# Altium project Urukul.PrjPCB
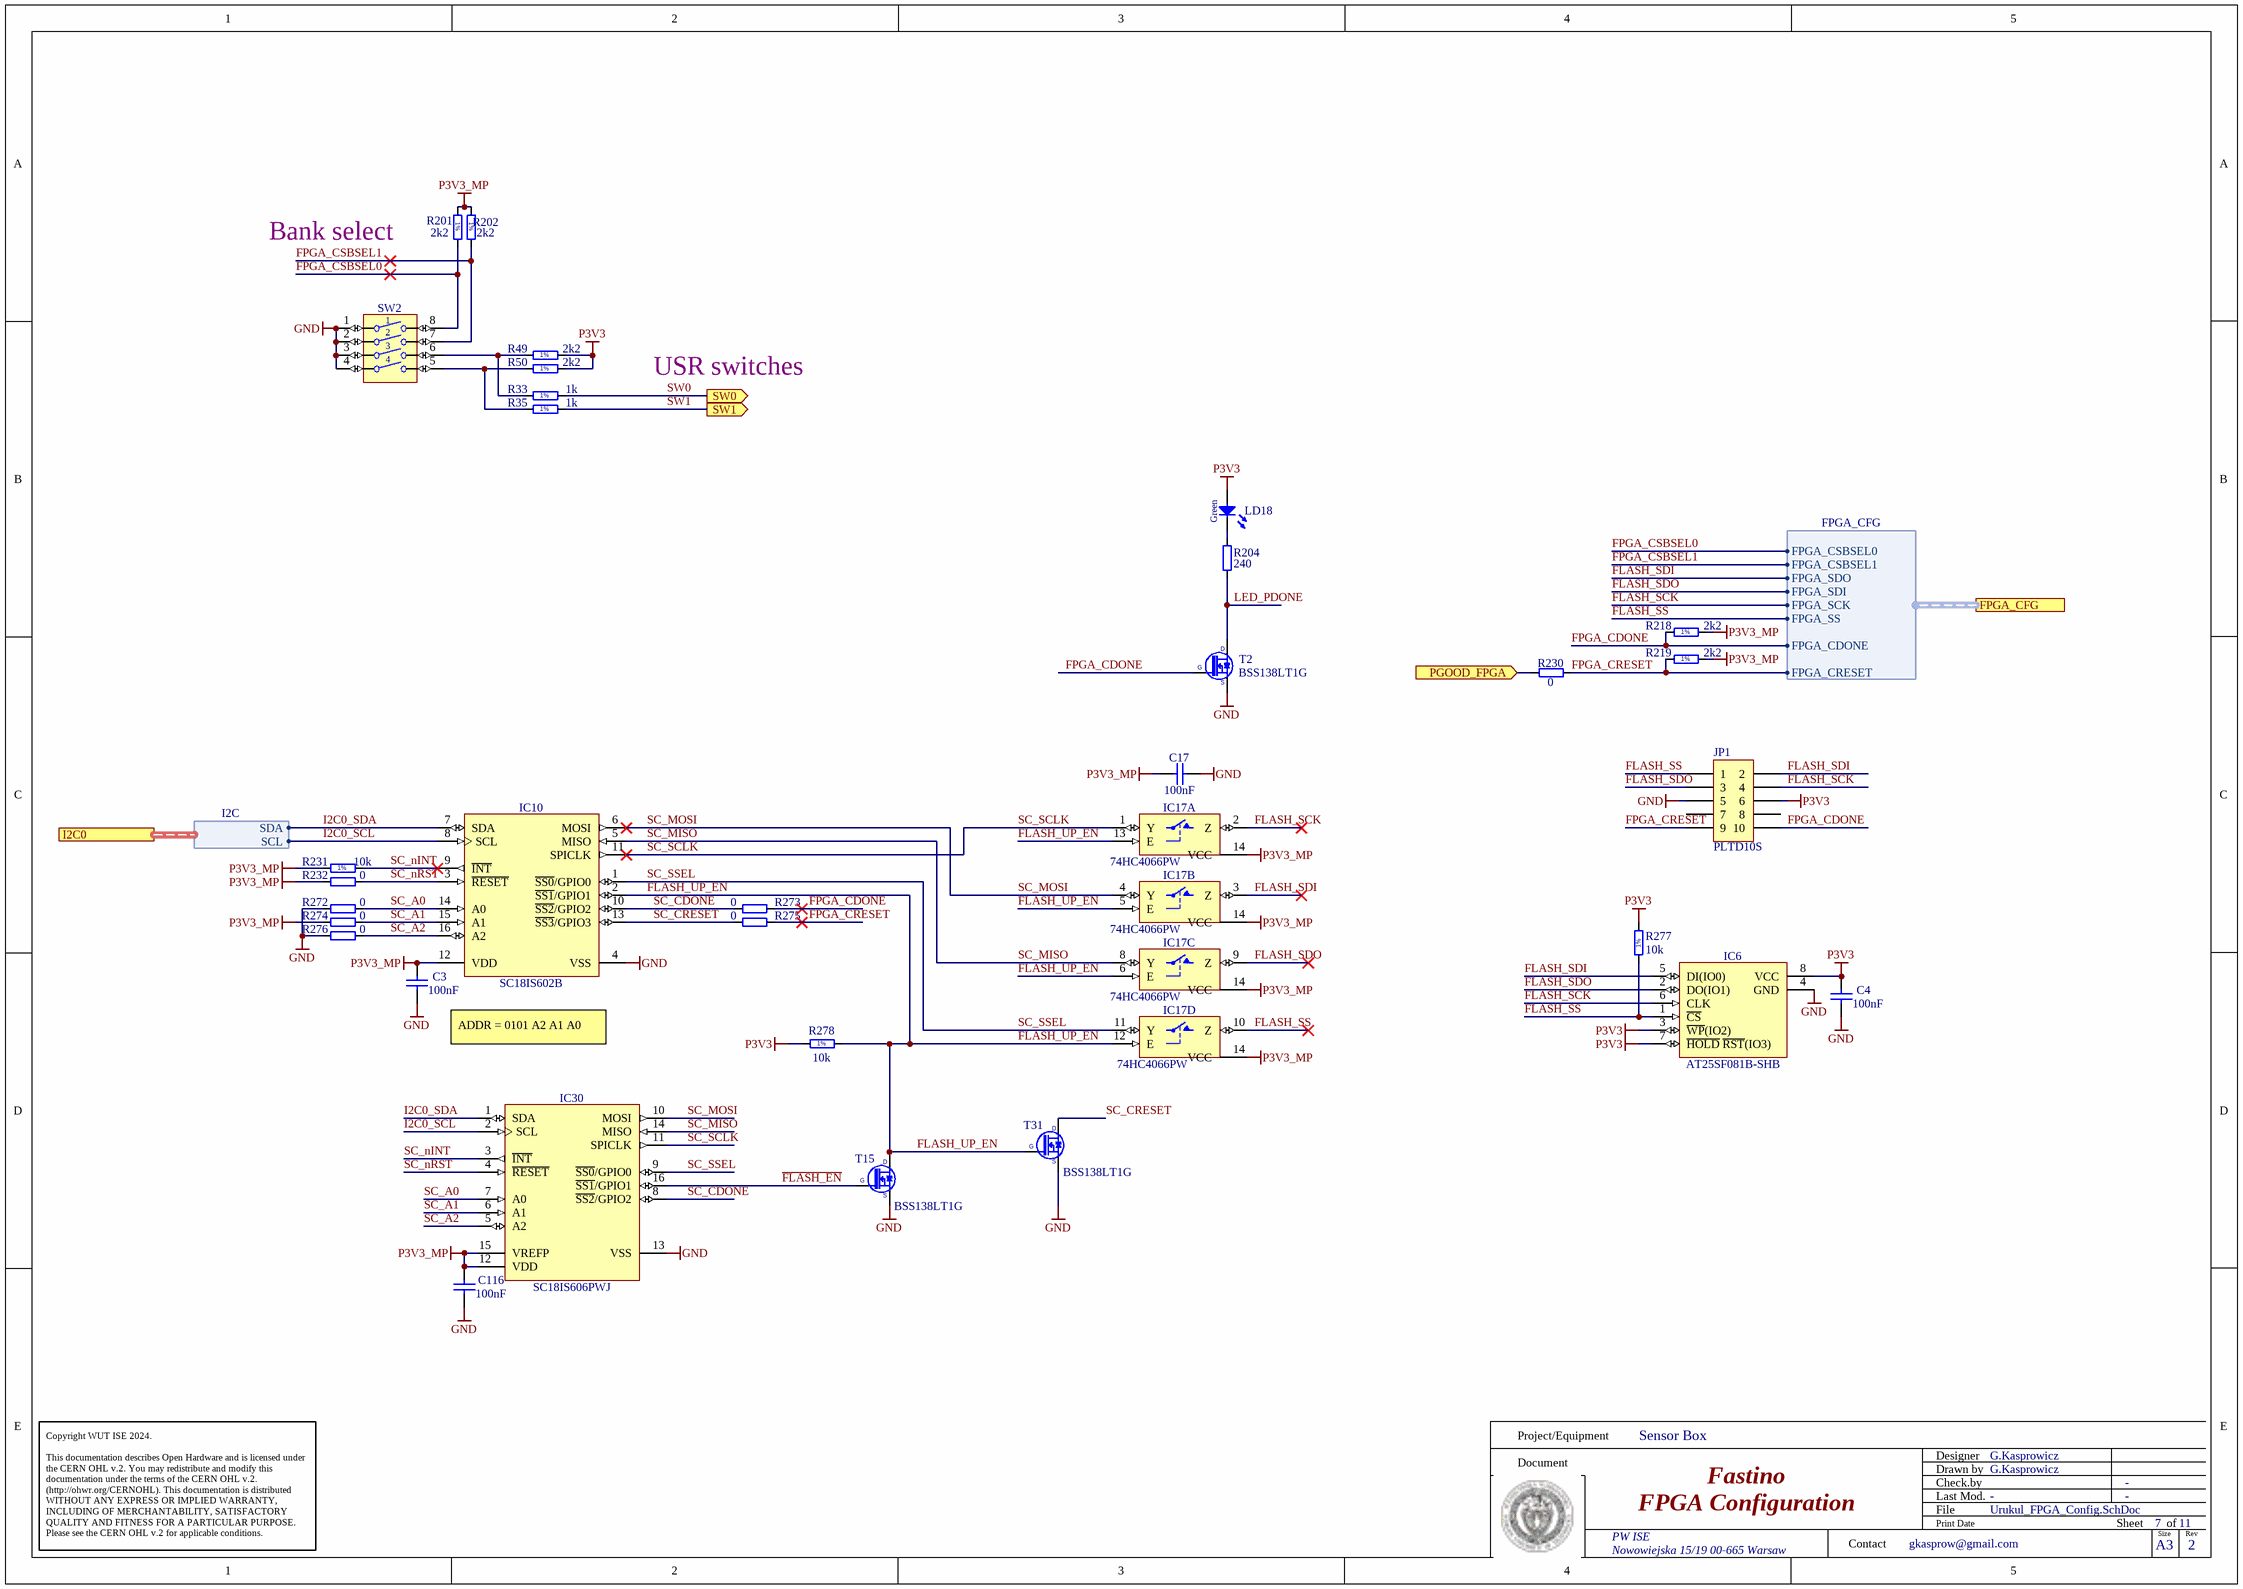
[diagram p0: Urukul_FPGA_Config.SchDoc]
P_version: 1.6.0
1 sheet, 33 parts. Net scope: hierarchical (ports join the sheet entries above them; power ports are global).
Board files: Urukul.PcbDoc, Panel_Urukul_9910.PcbDoc, Panel_Urukul_9912.PcbDoc

## Sheet Urukul_FPGA_Config.SchDoc: Fastino
size 420 x 297 mm; EDA_Number: ARTIQ; Projet: Fastino; Author: G.Kasprowicz; CompanyName: WUT ISE; DrawnBy: G.Kasprowicz; Organization: WUT ISE; Address1: PW ISE; Address2: Nowowiejska 15/19 00-665 Warsaw; Address3: gkasprow@gmail.com; DocumentNumber: 5; Revision: 2; SheetNumber: 7; SheetTotal: 11; ModifiedBy: -; CheckedDate: -; Title2: FPGA Configuration; DivGrp: WUT ISE; Designer: G.Kasprowicz; ModifiedDate: -; ProjectName: Sensor Box

### Parts
C3  100nF  [CAPC1005X55N]
C4  100nF  [CAPC1005X55N]
C17  100nF  [CAPC1005X55N]
C116  100nF  [CAPC1005X55N]
IC6  AT25SF081B-SHB  [SOIC127P790X216-8N]
IC10  SC18IS602B  [SOP65P640X110-16N]
IC17  74HC4066PW  [SOP65P640X110-14N]  (parts A,B,C,D of 4)
IC30  SC18IS606PWJ  [SOP65P640X110-16N]
JP1  PLTD10S  [PLTD10S]
LD18  Green  [LED_AVAGO_HSME-C120]
R33  1k  [RESC1005X40N]
R35  1k  [RESC1005X40N]
R49  2k2  [RESC1005X40N]
R50  2k2  [RESC1005X40N]
R201  2k2  [RESC1005X40N]
R202  2k2  [RESC1005X40N]
R204  240  [RESC1005X40N]
R218  2k2  [RESC1005X40N]
R219  2k2  [RESC1005X40N]
R230  0  [RESC1005X40N]
R231  10k  [RESC1005X40N]
R232  0  [RESC1005X40N]
R272  0  [RESC1005X40N]
R273  0  [RESC1005X40N]
R274  0  [RESC1005X40N]
R275  0  [RESC1005X40N]
R276  0  [RESC1005X40N]
R277  10k  [RESC1005X40N]
R278  10k  [RESC1005X40N]
SW2  Switch  [SW_TYCO_1571983-4]  (value not drawn)
T2  BSS138LT1G  [SOT95P240X110-3N]
T15  BSS138LT1G  [SOT95P240X110-3N]
T31  BSS138LT1G  [SOT95P240X110-3N]

### Ports
FPGA_CFG (harness FPGA_CFG), I2C0 (harness I2C), PGOOD_FPGA (in), SW0 (out), SW1 (out)

### Harnesses
FPGA_CFG: FPGA_CSBSEL0, FPGA_CSBSEL1, FPGA_SDO, FPGA_SDI, FPGA_SCK, FPGA_SS, FPGA_CDONE, FPGA_CRESET
I2C: SDA, SCL

### Nets
GND: C3.1 C4.1 C17.2 C116.1 IC6.4(GND) IC10.4(VSS) IC17.7(GND) IC30.13(VSS) JP1.5 R272.2 R276.2 SW2.1 SW2.2 SW2.3 SW2.4 T2.2(S) T15.2(S) T31.2(S)
P3V3: C4.2 IC6.3(~{WP}(IO2)) IC6.7(~{HOLD}_~{RST}(IO3)) IC6.8(VCC) JP1.6 LD18.2(A) R49.2 R50.2 R277.2 R278.1
P3V3_MP: C3.2 C17.1 C116.2 IC10.12(VDD) IC17.14(VCC) IC30.12(VDD) IC30.15(VREFP) R201.1 R202.1 R218.2 R219.2 R231.1 R232.2 R274.2
~{FLASH}~{_EN}: IC30.16(~{SS1}/GPIO1) T15.1(G)
FLASH_SCK: IC6.6(CLK) IC17.2(Z) JP1.4 ; port FPGA_CFG.FPGA_SCK
FLASH_SDI: IC6.5(DI(IO0)) IC17.3(Z) JP1.2 ; port FPGA_CFG.FPGA_SDO
FLASH_SDO: IC6.2(DO(IO1)) IC17.9(Z) JP1.3 ; port FPGA_CFG.FPGA_SDI
FLASH_SS: IC6.1(~{CS}) IC17.10(Z) JP1.1 R277.1 ; port FPGA_CFG.FPGA_SS
FLASH_UP_EN: IC10.2(~{SS1}/GPIO1) IC17.5(E) IC17.6(E) IC17.12(E) IC17.13(E) R278.2 T15.3(D) T31.1(G)
FPGA_CDONE: JP1.10 R218.1 R273.1 T2.1(G) ; port FPGA_CFG.FPGA_CDONE
FPGA_CRESET: JP1.9 R219.1 R230.2 R275.1 ; port FPGA_CFG.FPGA_CRESET
FPGA_CSBSEL0: R201.2 SW2.8 ; port FPGA_CFG.FPGA_CSBSEL0
FPGA_CSBSEL1: R202.2 SW2.7 ; port FPGA_CFG.FPGA_CSBSEL1
I2C0_SCL: IC10.8(SCL) IC30.2(SCL) ; port I2C0.SCL
I2C0_SDA: IC10.7(SDA) IC30.1(SDA) ; port I2C0.SDA
LED_PDONE: R204.1 T2.3(D)
PGOOD_FPGA: R230.1 ; port PGOOD_FPGA
SC_A0: IC10.14(A0) IC30.7(A0) R272.1
SC_A1: IC10.15(A1) IC30.6(A1) R274.1
SC_A2: IC10.16(A2) IC30.5(A2) R276.1
SC_CDONE: IC10.10(~{SS2}/GPIO2) IC30.8(~{SS2}/GPIO2) R273.2
SC_CRESET: IC10.13(~{SS3}/GPIO3) R275.2 T31.3(D)
SC_MISO: IC10.5(MISO) IC17.8(Y) IC30.14(MISO)
SC_MOSI: IC10.6(MOSI) IC17.4(Y) IC30.10(MOSI)
SC_nINT: IC10.9(~{INT}) IC30.3(~{INT}) R231.2
SC_nRST: IC10.3(~{RESET}) IC30.4(~{RESET}) R232.1
SC_SCLK: IC10.11(SPICLK) IC17.1(Y) IC30.11(SPICLK)
SC_SSEL: IC10.1(~{SS0}/GPIO0) IC17.11(Y) IC30.9(~{SS0}/GPIO0)
SW0: R33.2 ; port SW0
SW1: R35.2 ; port SW1
NetLD18_1: LD18.1(C) R204.2
NetR33_1: R33.1 R49.1 SW2.6
NetR35_1: R35.1 R50.1 SW2.5

Not connected (* = marked no-connect by the designer): JP1 7 8

### Notes on the sheet
- Bank select
- USR switches
- ADDR = 0101 A2 A1 A0
- Project/Equipment
- Document
- Designer
- Drawn by
- Check.by
- Copyright WUT ISE 2024.
  This documentation describes Open Hardware and is licensed under the CERN OHL v.2. You may redistribute and modify this documentation under the terms of the CERN OHL v.2. (http://ohwr.org/CERNOHL). This documentation is distributed WITHOUT ANY EXPRESS OR IMPLIED WARRANTY, INCLUDING OF MERCHANTABILITY, SATISFACTORY QUALITY AND FITNESS FOR A PARTICULAR PURPOSE. Please see the CERN OHL v.2 for applicable conditions.
- Contact
- File
- Last Mod.
- Print Date
- Sheet
- Size
- A3
- of
- Rev
- (in symbol R0402_1K_1%_0.0625W_100PPM) 1%
- (in symbol R0402_2K2_1%_0.0625W_100PPM) 1%
- (in symbol R0402_10K_1%_0.0625W_100PPM) 1%

### Library data of the parts
C3 C4 C17 C116 = CC0402_100NF_16V_10%_X5R: Non-polarised capacitor; Part Description: SMD Multilayer Chip Ceramic Capacitor; Manufacturer: GENERIC; Manufacturer1 Part Number: GRM155R61C104KA88D; Voltage: 16V; TC: X5R; Tolerance: ±10%; Part Number: CC0402_100NF_16V_10%_X5R; Component Kind: Standard; Component Type: Standard; Pin Count: 2; Value: 100nF; Status: None; Manufacturer Part Number: CC0402_100NF_16V_10%_X5R; Case: 0402; Mounted: Yes; Socket: No; SMD: Yes; Sense: No; Manufacturer1 Example: MURATA; Manufacturer1 ComponentHeight: 0.55mm; HelpURL: \\cern.ch\dfs\Applications\Altium\Datasheets\CC0402_X5R_MURATA_GRM.pdf; Author: CERN DEM JLC; CreateDate: 10.12.2013; LatestRevisionDate: 10.12.2013
IC6 = MEM_AT25SF081B-SHB: 8M-bit Serial Flash Memory with uniform 4KB sectors and Dual/Quad SPI and QPI; Manufacturer: Renesas; PressFit: No; Bonding: No; Part Number: AT25SF081B-SHB; Component Kind: Standard; Component Type: Standard; Device: AT25SF081B-SHB; PackageDescription: SOIC, 1.27mm Pitch; 8 Pin, 5.285mm W X 5.335mm L X 2.16mm H body, IPC Medium Density; Part Description: 8M-bit Serial Flash Memory with uniform 4KB sectors and Dual/Quad SPI and QPI; Manufacturer Part Number: AT25SF081B-SHB; Pin Count: 8; Case: SOIC8; Mounted: Yes; Socket: No; SMD: Yes; Sense: No; ComponentHeight: 2.16mm; HelpURL: \\cern.ch\dfs\Applications\Altium\Datasheets\W25Q128FVSIG.pdf; Author: GK; CreateDate: 26/01/2018; LatestRevisionDate: 26/01/2018
IC10 = SC18IS602B: I2C-bus to SPI bridge; Manufacturer: NXP SEMICONDUCTORS; PressFit: No; Bonding: No; Part Number: SC18IS602B; Component Kind: Standard; Component Type: Standard; Device: SC18IS602B; PackageDescription: SOP, 0.65mm pitch; 16 pin, 4.40mm W X 5.00mm L X 1.10mm H body IPC Medium Density; Part Description: I2C-Bus to SPI Bridge; Manufacturer Part Number: SC18IS602B; Pin Count: 16; Case: TSSOP16; Mounted: Yes; Socket: No; SMD: Yes; Sense: No; ComponentHeight: 1.1mm; HelpURL: \\cern.ch\dfs\Applications\Altium\Datasheets\SC18IS602B.pdf; Author: CERN DEM MR; CreateDate: 14/12/2015; LatestRevisionDate: 14/12/2015
IC17 = 74HC4066PW: Part Description: Quad Single-Pole Single-Throw Analog Switch; Manufacturer: NXP SEMICONDUCTORS; PressFit: No; Bonding: No; Table: Standard Logic; Part Number: 74HC4066PW; Component Kind: Standard; Component Type: Standard; Device: 74HC4066PW; PackageDescription: SOP, 14-Leads, Body 4.4x5mm (max), Pitch 0.65mm, IPC Medium Density; Manufacturer Part Number: 74HC4066PW; Pin Count: 14; Case: TSSOP14; Mounted: Yes; Socket: No; SMD: Yes; ComponentHeight: 1.1mm; Author: CERN DEM JLC; HelpURL: \\cern.ch\dfs\Applications\Altium\Datasheets\74HC4066PW.pdf; CreateDate: 2014-11-19; LatestRevisionDate: 2014-11-19
IC30 = SC18IS606PWJ: I2C-bus to SPI bridge; Manufacturer: NXP SEMICONDUCTORS; PressFit: No; Bonding: No; Part Number: SC18IS606PWJ; Component Kind: Standard; Component Type: Standard; Device: SC18IS606PWJ; PackageDescription: SOP, 0.65mm pitch; 16 pin, 4.40mm W X 5.00mm L X 1.10mm H body IPC Medium Density; Part Description: I2C-Bus to SPI Bridge; Manufacturer Part Number: SC18IS606PWJ; Pin Count: 16; Case: TSSOP16; Mounted: Yes; Socket: No; SMD: Yes; Sense: No; ComponentHeight: 1.1mm; HelpURL: \\cern.ch\dfs\Applications\Altium\Datasheets\SC18IS602B.pdf; Author: GK; CreateDate: 14/12/2015; LatestRevisionDate: 14/12/2015
JP1 = CON_2x5 2.54 male SMT: Goldpin 2.54mm, male header; Manufacturer: Maritex; Manufacturer Part Number: PLTD10S; Part Number: PLTD10S
LD18 = LED_AVAGO_HSME-C120: LED Green 1C 2A; Part Description: High Performance Right Angle Chip Green LED; Manufacturer: AVAGO TECHNOLOGIES; PressFit: No; Bonding: No; Part Number: LED_AVAGO_HSME-C120; Component Kind: Standard; Component Type: Standard; Color: Green; PackageDescription: Green Chip LED, 2-Leads, Body 1.7x1.1mm, Side Emitting Package; Manufacturer Part Number: HSME-C120; Pin Count: 2; Mounted: Yes; Socket: No; SMD: Yes; Sense: No; ComponentHeight: 0.7mm; HelpURL: \\cern.ch\dfs\Applications\Altium\Datasheets\LED_AVAGO_HSME-C120.pdf; ComponentLink1URL: \\cern.ch\dfs\Applications\Altium\Datasheets\LED_AVAGO_HSME-C110_DESIGN-GUIDE.pdf; ComponentLink1Description: Design Guide; Author: CERN DEM JMW; CreateDate: 22.07.2009; LatestRevisionDate: 20.06.2012
R33 R35 = R0402_1K_1%_0.0625W_100PPM: Resistor - 1%; Part Description: General Purpose Thick Film Chip Resistor; Manufacturer: GENERIC; Manufacturer1 Part Number: 232270671002L; TC: ±100ppm/°C; PressFit: No; Part Number: R0402_1K_1%_0.0625W_100PPM; Component Kind: Standard; Component Type: Standard; Pin Count: 2; Value: 1k; Status: Not Recommended; Power: 0.0625W; Tolerance: ±1%; Manufacturer Part Number: R0402_1K_1%_0.0625W_100PPM; Case: 0402; Mounted: Yes; Socket: No; SMD: Yes; Manufacturer1 Example: YAGEO PHYCOMP; Manufacturer1 ComponentHeight: 0.4mm; HelpURL: \\cern.ch\dfs\Applications\Altium\Datasheets\R0402_Phycomp_RC0402.pdf; Author: CERN DEM JLC; CreateDate: 03.12.2007; LatestRevisionDate: 17.10.2012; Sense: No
R49 R50 R201 R202 R218 R219 = R0402_2K2_1%_0.0625W_100PPM: Resistor - 1%; Part Description: General Purpose Thick Film Chip Resistor; Manufacturer: GENERIC; Manufacturer1 Part Number: 232270672202L; TC: ±100ppm/°C; Table: Resistors SMD; Part Number: R0402_2K2_1%_0.0625W_100PPM; Component Kind: Standard; Component Type: Standard; Pin Count: 2; Value: 2k2; Status: Not recommended; Power: 0.0625W; Tolerance: ±1%; Manufacturer Part Number: R0402_2K2_1%_0.0625W_100PPM; Case: 0402; Mounted: Yes; Socket: No; SMD: Yes; Manufacturer1 Example: YAGEO PHYCOMP; Manufacturer1 ComponentHeight: 0.4mm; HelpURL: \\cern.ch\dfs\Applications\Altium\Datasheets\R0402_Phycomp_RC0402.pdf; Author: CERN DEM JLC; CreateDate: 2007-12-03; LatestRevisionDate: 2012-10-17
R204 = R0402_240R_1%_0.0625W_100PPM: Resistor - 1%; Part Description: General Purpose Thick Film Chip Resistor; Manufacturer: GENERIC; Manufacturer1 Part Number: 232270672401L; TC: ±100ppm/°C; PressFit: No; Part Number: R0402_240R_1%_0.0625W_100PPM; Component Kind: Standard; Component Type: Standard; Pin Count: 2; Value: 240; Status: Not Recommended; Power: 0.0625W; Tolerance: ±1%; Manufacturer Part Number: R0402_240R_1%_0.0625W_100PPM; Case: 0402; Mounted: Yes; Sense: No; Socket: No; SMD: Yes; Manufacturer1 Example: YAGEO PHYCOMP; Manufacturer1 ComponentHeight: 0.4mm; HelpURL: \\cern.ch\dfs\Applications\Altium\Datasheets\R0402_Phycomp_RC0402.pdf; Author: CERN DEM JLC; CreateDate: 03.12.2007; LatestRevisionDate: 17.10.2012
R230 R232 R272-R276 = R0402_0R_JUMPER: Resistor; Part Description: 1A (0.05R Max DC Resistance) Zero Ohm Jumper; Manufacturer: GENERIC; Manufacturer1 Part Number: 232270591001L; PressFit: No; Part Number: R0402_0R_JUMPER; Component Kind: Standard; Component Type: Standard; Pin Count: 2; Value: 0; Status: Not Recommended; Manufacturer Part Number: R0402_0R_JUMPER; Case: 0402; Mounted: Yes; Socket: No; SMD: Yes; Manufacturer1 Example: YAGEO PHYCOMP; Manufacturer1 ComponentHeight: 0.4mm; HelpURL: \\cern.ch\dfs\Applications\Altium\Datasheets\R0402_Phycomp_RC0402.pdf; Author: CERN DEM JLC; CreateDate: 03.12.2007; LatestRevisionDate: 17.10.2012; Sense: No
R231 R277 R278 = R0402_10K_1%_0.0625W_100PPM: Resistor - 1%; Part Description: General Purpose Thick Film Chip Resistor; Manufacturer: GENERIC; Manufacturer1 Part Number: 232270671003L; TC: ±100ppm/°C; Table: Resistors SMD; Part Number: R0402_10K_1%_0.0625W_100PPM; Component Kind: Standard; Component Type: Standard; Pin Count: 2; Value: 10k; Status: Not recommended; Power: 0.0625W; Tolerance: ±1%; Manufacturer Part Number: R0402_10K_1%_0.0625W_100PPM; Case: 0402; Mounted: Yes; Socket: No; SMD: Yes; Manufacturer1 Example: YAGEO PHYCOMP; Manufacturer1 ComponentHeight: 0.4mm; HelpURL: \\cern.ch\dfs\Applications\Altium\Datasheets\R0402_Phycomp_RC0402.pdf; Author: CERN DEM JLC; CreateDate: 2007-12-03; LatestRevisionDate: 2012-10-17
SW2 = SW_TYCO_1571983-4: 4 Ways SPST DIP Switch; Part Description: 4 Way SPST SMD DIP Switch, Latched, Contact Rating 0.025A 24VDC; Manufacturer: TYCO; Manufacturer Part Number: 1571983-4 or GDH04S04; PressFit: No; Part Number: SW_TYCO_1571983-4; Component Kind: Standard; Component Type: Standard; Pin Count: 8; PackageDescription: Pitch 1.27mm,  Body 6.2x6.2mm, 4 Ways SPST Surface-Mount DIP Switch, TYCO GDH Series; Family: Switch; Mounted: Yes; Socket: No; SMD: Yes; Sense: No; Status: None; ComponentHeight: 2.31mm; HelpURL: \\cern.ch\dfs\Applications\Altium\Datasheets\SW_TYCO_1571983-4.pdf; Author: CERN DEM JLC; CreateDate: 08/01/2009; LatestRevisionDate: 08/01/2009
T2 T15 T31 = BSS138LT1G: N-CHANNEL MOSFET WITH DIODE; Part Description: 50V 200mA N-Channel Enhancement Mode Field-Effect Transistor; Manufacturer: ON SEMICONDUCTOR; PressFit: No; Bonding: No; Part Number: BSS138LT1G; Component Kind: Standard; Component Type: Standard; Device: BSS138LT1G; PackageDescription: SOT23 3-Leads, Pitch 0.95mm - Body 1.4x3mm, IPC Medium Density; Manufacturer Part Number: BSS138LT1G; Pin Count: 3; Case: SOT23-3; Mounted: Yes; Socket: No; SMD: Yes; Sense: No; ComponentHeight: 1.11mm; HelpURL: \\cern.ch\dfs\Applications\Altium\Datasheets\BSS138LT1G.pdf; Author: CERN DEM JLC; CreateDate: 23.03.2009; LatestRevisionDate: 23.03.2009

## Assembly variants
EEM_AD9910: not fitted C30A C30B C30C C30D C44A C44B C44C C44D C50A C50B C50C C50D C57 C58 C59 C60 C62 C69 C80 C88 C92 C93 C107A C107B C107C C107D C113 C121 C127A C127B C127C C127D C128A C128B C128C C128D C133A C133B C133C C133D C134A C134B C134C C134D C135A C135B C135C C135D C136A C136B C136C C136D C137A C137B C137C C137D C138A C138B C138C C138D C139 C140A C140B C140C C140D C141A C141B C141C C141D C142A C142B C142C C142D C143A C143B C143C C143D C144A C144B C144C C144D C146A C146B C146C C146D C147A C147B C147C C147D C148A C148B C148C C148D C149A C149B C149C C149D C150A C150B C150C C150D C164A C164B C164C C164D C172A C172B C172C C172D C176A C176B C176C C176D C180A C180B C180C C180D C191 C195 C202A C202B C202C C202D C203A C203B C203C C203D C204A C204B C204C C204D C205A C205B C205C C205D C206A C206B C206C C206D C207A C207B C207C C207D C213 C214 CLIP1 CLIP2 CLIP3 CLIP4 CLIP5 CLIP6 CLIP7 CLIP8 CLIP9 CLIP10 CLIP11 CLIP12 CLIP13 CLIP14 CLIP15 CLIP16 CLIP17 CLIP18 CLIP19 CLIP20 CLIP21 CLIP22 CLIP23 CLIP24 CLIP25 CLIP26 CLIP27 CLIP28 CLIP29 CLIP30 CLIP31 D5 FTG1 FTG2 FTG3 FTG4 IC8 IC10 IC13A IC13B IC13C IC13D IC14 IC22 IC25 J1 J8 J9 J10 J11 L17A L17B L17C L17D L20A L20B L20C L20D L21A L21B L21C L21D OSC2 R1 R3 R3A R3B R3C R3D R4A R4B R4C R4D R8A R8B R8C R8D R12A R12B R12C R12D R15A R15B R15C R15D R22 R34 R37 R42 R48A R48B R48C R48D R49A R49B R49C R49D R50A R50B R50C R50D R51A R51B R51C R51D R60 R61 R62 R63 R69 R70 R71 R72 R76 R77 R79A R79B R79C R79D R89A R89B R89C R89D R91A R91B R91C R91D R93A R93B R93C R93D R94A R94B R94C R94D R95 R96A R96B R96C R96D R97A R97B R97C R97D R98A R98B R98C R98D R99A R99B R99C R99D R101 R102 R103 R104A R104B R104C R104D R105A R105B R105C R105D R106A R106B R106C R106D R107A R107B R107C R107D R110 R113A R113B R113C R113D R134 R136 R140A R140B R140C R140D R166 R167 R168 R178A R178B R178C R178D R190 R191 R193 R205 R233 R235 R236 R238 R239 R240 R241 R242 R243 R244 R245 R246 R247 R248 R249 R250 R251 R252 R253 R254 R255 R256 R257 R258 R259 R260 R261 R262 R263 R264 R265 R266 R267 TR2 TR3 TR4 TR5 TR6 TR7 TR8A TR8B TR8C TR8D
EEM_AD9912: not fitted C1 C13 C43A C43B C43C C43D C44A C44B C44C C44D C45 C46 C50A C50B C50C C50D C51A C51B C51C C51D C52A C52B C52C C52D C53A C53B C53C C53D C56 C61 C65 C66 C68 C69 C71 C72A C72B C72C C72D C80 C82A C82B C82C C82D C83A C83B C83C C83D C85A C85B C85C C85D C86 C89 C90 C95 C96 C99A C99B C99C C99D C105A C105B C105C C105D C106A C106B C106C C106D C108A C108B C108C C108D C109A C109B C109C C109D C110A C110B C110C C110D C111A C111B C111C C111D C112A C112B C112C C112D C113 C116A C116B C116C C116D C117A C117B C117C C117D C118A C118B C118C C118D C119A C119B C119C C119D C120A C120B C120C C120D C121 C124A C124B C124C C124D C139 C157A C157B C157C C157D C158A C158B C158C C158D C159A C159B C159C C159D C164A C164B C164C C164D C172A C172B C172C C172D C176A C176B C176C C176D C180A C180B C180C C180D C191 C195 C202A C202B C202C C202D C203A C203B C203C C203D C204A C204B C204C C204D C205A C205B C205C C205D C206A C206B C206C C206D C207A C207B C207C C207D C213 C214 CLIP1 CLIP2 CLIP3 CLIP4 CLIP5 CLIP6 CLIP7 CLIP8 CLIP9 CLIP10 CLIP11 CLIP12 CLIP13 CLIP14 CLIP15 CLIP16 CLIP17 CLIP18 CLIP19 CLIP20 CLIP21 CLIP22 CLIP23 CLIP24 CLIP25 CLIP26 CLIP27 CLIP28 CLIP29 CLIP30 CLIP31 D5 FTG1 FTG2 FTG3 FTG4 IC2A IC2B IC2C IC2D IC4 IC8 IC9 IC10 IC14 IC16 IC22 IC25 J1 J8 J9 J10 J11 L8 L13 OSC2 R1 R3 R3A R3B R3C R3D R4A R4B R4C R4D R10A R10B R10C R10D R22 R31 R32 R34 R36 R37 R38A R38B R38C R38D R39 R42 R54A R54B R54C R54D R56A R56B R56C R56D R60 R61 R62 R63 R68 R69 R70 R71 R72 R76 R77 R78A R78B R78C R78D R88A R88B R88C R88D R90A R90B R90C R90D R92A R92B R92C R92D R95 R101 R102 R108 R109 R112A R112B R112C R112D R114 R134 R136 R148 R166 R167 R168 R178A R178B R178C R178D R190 R191 R193 R205 R233 R235 R236 R238 R239 R240 R241 R242 R243 R244 R245 R246 R247 R248 R249 R250 R251 R252 R253 R254 R255 R256 R257 R258 R259 R260 R261 R262 R263 R264 R265 R266 R267 TR2 TR3 TR4 TR5 TR6 TR7 TR8A TR8B TR8C TR8D
DIOT_AD9910: not fitted C30A C30B C30C C30D C44A C44B C44C C44D C50A C50B C50C C50D C57 C58 C59 C60 C62 C69 C80 C88 C92 C93 C107A C107B C107C C107D C113 C121 C127A C127B C127C C127D C128A C128B C128C C128D C133A C133B C133C C133D C134A C134B C134C C134D C135A C135B C135C C135D C136A C136B C136C C136D C137A C137B C137C C137D C138A C138B C138C C138D C139 C140A C140B C140C C140D C141A C141B C141C C141D C142A C142B C142C C142D C143A C143B C143C C143D C144A C144B C144C C144D C146A C146B C146C C146D C147A C147B C147C C147D C148A C148B C148C C148D C149A C149B C149C C149D C150A C150B C150C C150D C164A C164B C164C C164D C172A C172B C172C C172D C176A C176B C176C C176D C180A C180B C180C C180D C191 C195 C202A C202B C202C C202D C203A C203B C203C C203D C204A C204B C204C C204D C205A C205B C205C C205D C206A C206B C206C C206D C207A C207B C207C C207D C213 C214 CLIP1 CLIP2 CLIP3 CLIP4 CLIP5 CLIP6 CLIP7 CLIP8 CLIP9 CLIP10 CLIP11 CLIP12 CLIP13 CLIP14 CLIP15 CLIP16 CLIP17 CLIP18 CLIP19 CLIP20 CLIP21 CLIP22 CLIP23 CLIP24 CLIP25 CLIP26 CLIP27 CLIP28 CLIP29 CLIP30 CLIP31 D1 D2 FTG1 FTG2 FTG3 FTG4 IC8 IC10 IC13A IC13B IC13C IC13D IC14 IC22 IC25 J9 J10 J12 J13 L17A L17B L17C L17D L20A L20B L20C L20D L21A L21B L21C L21D OSC2 R3A R3B R3C R3D R4A R4B R4C R4D R8A R8B R8C R8D R12A R12B R12C R12D R15A R15B R15C R15D R22 R34 R37 R42 R48A R48B R48C R48D R49A R49B R49C R49D R50A R50B R50C R50D R51A R51B R51C R51D R60 R61 R62 R63 R69 R70 R71 R72 R76 R77 R79A R79B R79C R79D R89A R89B R89C R89D R91A R91B R91C R91D R93A R93B R93C R93D R94A R94B R94C R94D R95 R96A R96B R96C R96D R97A R97B R97C R97D R98A R98B R98C R98D R99A R99B R99C R99D R101 R102 R103 R104A R104B R104C R104D R105A R105B R105C R105D R106A R106B R106C R106D R107A R107B R107C R107D R110 R113A R113B R113C R113D R134 R136 R140A R140B R140C R140D R166 R167 R168 R178A R178B R178C R178D R190 R191 R193 TR2 TR3 TR4 TR5 TR6 TR7 TR8A TR8B TR8C TR8D
DIOT_AD9912: not fitted C1 C13 C43A C43B C43C C43D C44A C44B C44C C44D C45 C46 C50A C50B C50C C50D C51A C51B C51C C51D C52A C52B C52C C52D C53A C53B C53C C53D C56 C61 C65 C66 C68 C69 C71 C72A C72B C72C C72D C80 C82A C82B C82C C82D C83A C83B C83C C83D C85A C85B C85C C85D C86 C89 C90 C95 C96 C99A C99B C99C C99D C105A C105B C105C C105D C106A C106B C106C C106D C108A C108B C108C C108D C109A C109B C109C C109D C110A C110B C110C C110D C111A C111B C111C C111D C112A C112B C112C C112D C113 C116A C116B C116C C116D C117A C117B C117C C117D C118A C118B C118C C118D C119A C119B C119C C119D C120A C120B C120C C120D C121 C124A C124B C124C C124D C139 C157A C157B C157C C157D C158A C158B C158C C158D C159A C159B C159C C159D C164A C164B C164C C164D C172A C172B C172C C172D C176A C176B C176C C176D C180A C180B C180C C180D C191 C195 C202A C202B C202C C202D C203A C203B C203C C203D C204A C204B C204C C204D C205A C205B C205C C205D C206A C206B C206C C206D C207A C207B C207C C207D C213 C214 CLIP1 CLIP2 CLIP3 CLIP4 CLIP5 CLIP6 CLIP7 CLIP8 CLIP9 CLIP10 CLIP11 CLIP12 CLIP13 CLIP14 CLIP15 CLIP16 CLIP17 CLIP18 CLIP19 CLIP20 CLIP21 CLIP22 CLIP23 CLIP24 CLIP25 CLIP26 CLIP27 CLIP28 CLIP29 CLIP30 CLIP31 D1 D2 FTG1 FTG2 FTG3 FTG4 IC2A IC2B IC2C IC2D IC4 IC8 IC9 IC10 IC14 IC16 IC22 IC25 J9 J10 J12 J13 L8 L13 OSC2 R3A R3B R3C R3D R4A R4B R4C R4D R10A R10B R10C R10D R22 R31 R32 R34 R36 R37 R38A R38B R38C R38D R39 R42 R54A R54B R54C R54D R56A R56B R56C R56D R60 R61 R62 R63 R68 R69 R70 R71 R72 R76 R77 R78A R78B R78C R78D R88A R88B R88C R88D R90A R90B R90C R90D R92A R92B R92C R92D R95 R101 R102 R108 R109 R112A R112B R112C R112D R114 R134 R136 R148 R166 R167 R168 R178A R178B R178C R178D R190 R191 R193 TR2 TR3 TR4 TR5 TR6 TR7 TR8A TR8B TR8C TR8D